# EAGLE design SSTC (EAGLE 9.2.0)
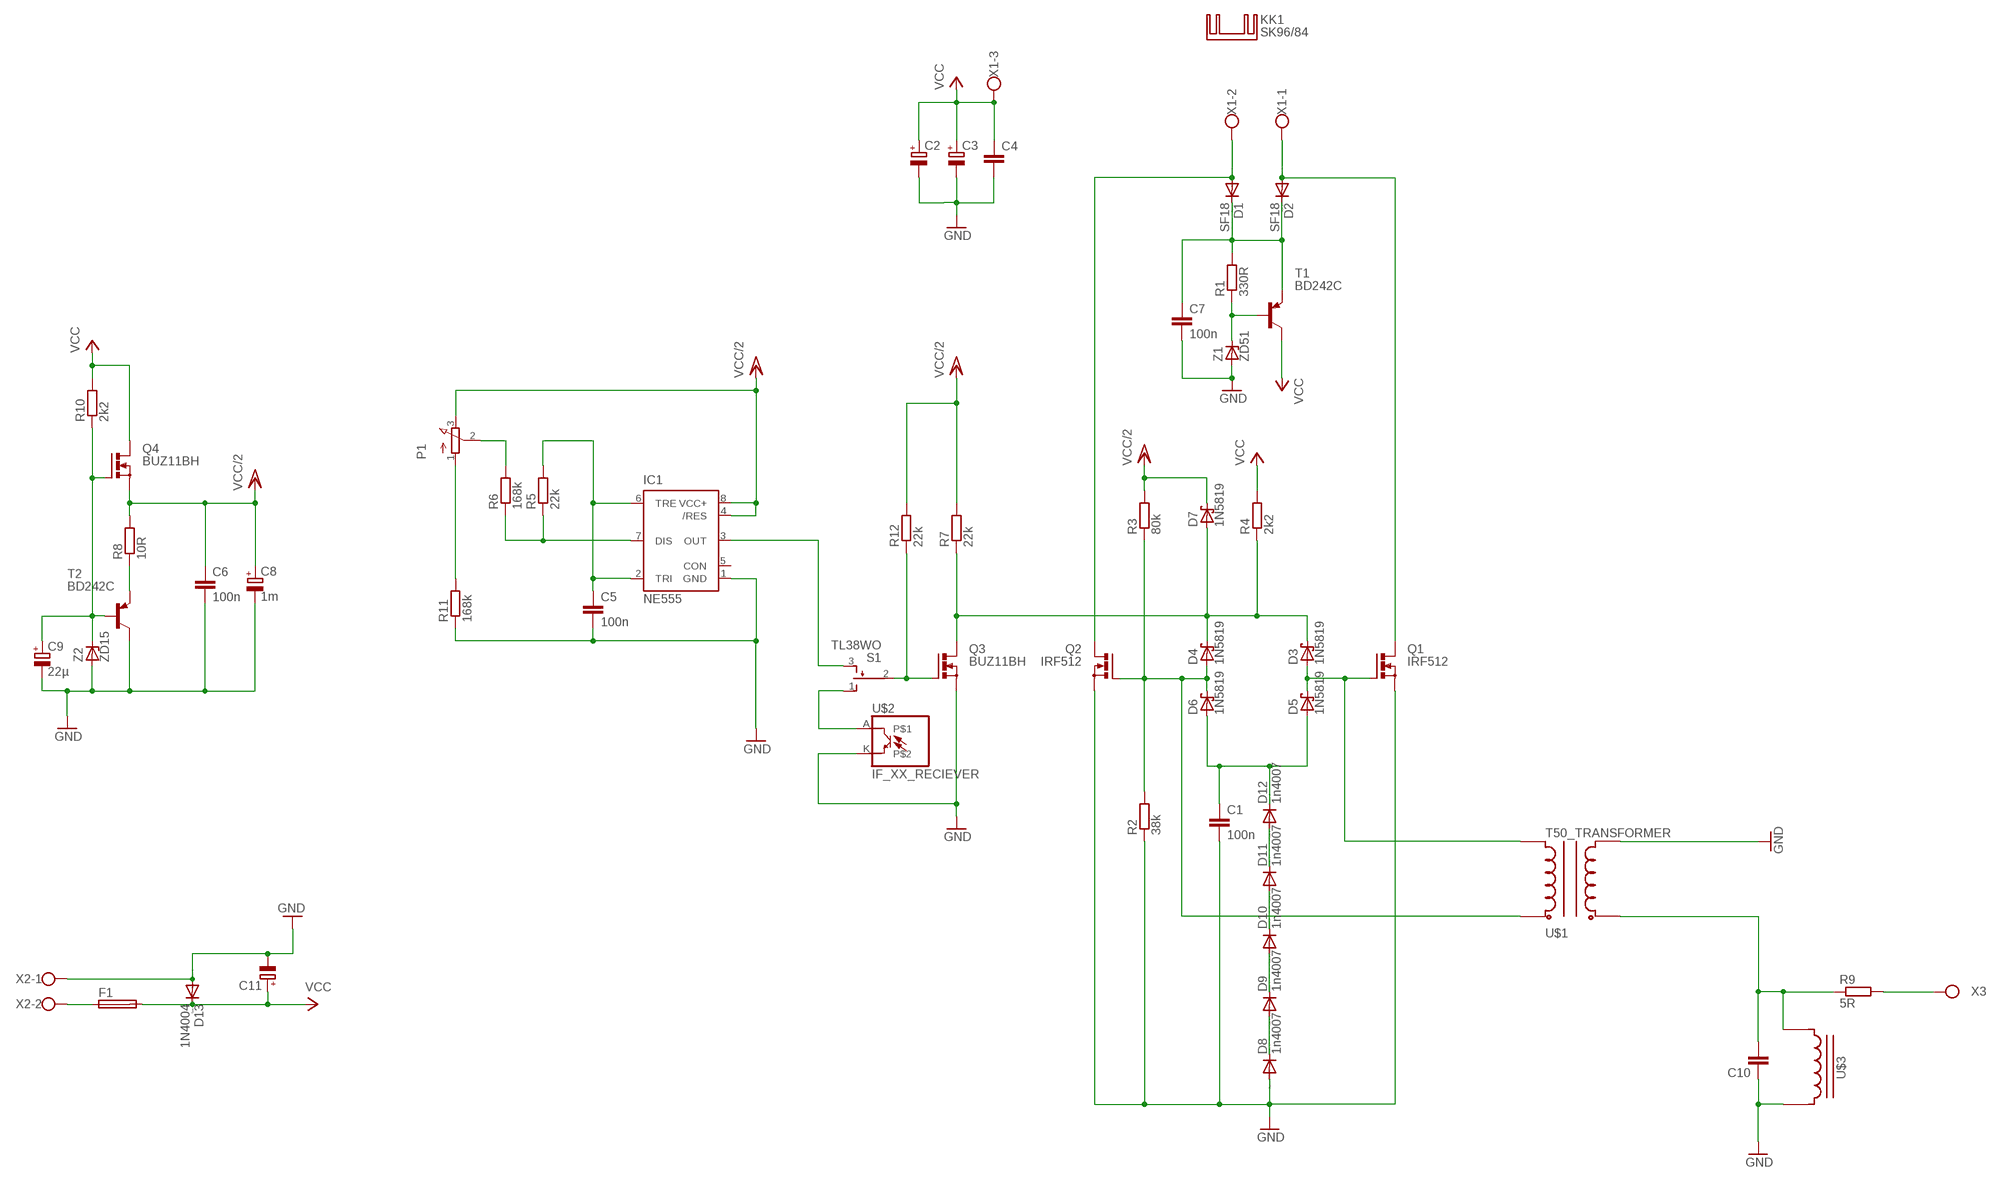
[diagram p0: schematic, sheet 1]

## Parts
C1  100n  C-EU075-032X103  [C075-032X103]
C2  CPOL-EUE7.5-18  [E7,5-18]
C3  CPOL-EUE7.5-18  [E7,5-18]
C4  C-EU150-072X183  [C150-072X183]
C5  100n  C-EU075-032X103  [C075-032X103]
C6  100n  C-EU075-032X103  [C075-032X103]
C7  100n  C-EU075-032X103  [C075-032X103]
C8  1m  CPOL-EUE5-10.5  [E5-10,5]
C9  22µ  CPOL-EUE5-8.5  [E5-8,5]
C10  C-EU102_152-062X184  [C102_152-062X184]
C11  CPOL-EUE7.5-18  [E7,5-18]
D1  SF18  DIODE-DO35-10  [DO35-10]
D2  SF18  DIODE-DO35-10  [DO35-10]
D3  1N5819  SCHOTTKY-DIODEF126Z12  [F126Z12]
D4  1N5819  SCHOTTKY-DIODEF126Z12  [F126Z12]
D5  1N5819  SCHOTTKY-DIODEF126Z12  [F126Z12]
D6  1N5819  SCHOTTKY-DIODEF126Z12  [F126Z12]
D7  1N5819  SCHOTTKY-DIODEF126Z12  [F126Z12]
D8  1n4007  DIODE-D-10  [D-10]
D9  1n4007  DIODE-D-10  [D-10]
D10  1n4007  DIODE-D-10  [D-10]
D11  1n4007  DIODE-D-10  [D-10]
D12  1n4007  DIODE-D-10  [D-10]
D13  1N4004  [DO41-10]
F1  SH22,5A  [SH22,5A]
IC1  NE555  [DIL-08]
KK1  SK96/84  [SK96/84]
P1  3RP/1610N  [3RP/1610N]
Q1  IRF512  [TO220BV]
Q2  IRF512  [TO220BV]
Q3  BUZ11BH  [TO220BH]
Q4  BUZ11BH  [TO220BH]
R1  330R  R-EU_0207/10  [0207/10]
R2  38k  R-EU_0207/10  [0207/10]
R3  80k  R-EU_0207/10  [0207/10]
R4  2k2  R-EU_0207/10  [0207/10]
R5  22k  R-EU_0207/10  [0207/10]
R6  168k  R-EU_0207/10  [0207/10]
R7  22k  R-EU_0207/10  [0207/10]
R8  10R  R-EU_0309/12  [0309/12]
R9  5R  R-EU_0613/5V  [P0613V]
R10  2k2  R-EU_0207/10  [0207/10]
R11  168k  R-EU_0309/12  [0309/12]
R12  22k  R-EU_0309/12  [0309/12]
S1  TL38WO  [TL3XWO]
T1  BD242C  -PNP-TO220V  [TO220V]
T2  BD242C  -PNP-TO220V  [TO220V]
U$1  T50_TRANSFORMER  [T50_TRANSFORMER]
U$2  IF_XX_RECIEVER  [IF_XX]
U$3  T50_INDUCTOR  [T50_INDUCTOR]
X1  W237-103  [W237-103]
X2  W237-102  [W237-102]
X3  W237-112  [W237-112]
Z1  ZD51  ZENER-DIODEDO35Z10  [DO35Z10]
Z2  ZD15  ZENER-DIODEDO35Z10  [DO35Z10]

## Nets
GND: C1.2 C2.- C3.- C4.2 C5.2 C6.2 C7.2 C8.- C9.- C10.1 C11.- D8.A D13.A IC1.1(GND) Q1.S Q2.S Q3.S R2.1 R11.1 T2.2(C) U$1.C2A U$2.K U$3.CA X2.1 Z1.A Z2.A
N$1: D8.C D9.A
N$2: D9.C D10.A
N$3: D10.C D11.A
N$4: D11.C D12.A
N$5: C1.1 D5.A D6.A D12.C
N$6: D4.A D6.C Q2.G R2.2 R3.1 U$1.C1B
N$7: D3.A D5.C Q1.G U$1.C1A
N$8: D1.A Q2.D X1.2
N$9: D2.A Q1.D X1.1
N$10: D3.C D4.C D7.A Q3.D R4.1 R7.1
N$11: C7.1 D1.C D2.C R1.2 T1.3(E)
N$12: R1.1 T1.1(B) Z1.C
N$13: C10.2 R9.1 U$1.C2B U$3.CB
N$14: R9.2 X3.1(KL)
N$15: F1.1 X2.2
N$16: C9.+ Q4.G R10.1 T2.1(B) Z2.C
N$17: R8.1 T2.3(E)
N$18: IC1.7(DIS) R5.1 R6.1
N$19: C5.1 IC1.2(TRI) IC1.6(TRE) R5.2
N$20: P1.2(S) R6.2
N$21: P1.1(A) R11.2
N$22: Q3.G R12.1 S1.2(P)
N$23: IC1.3(OUT) S1.3(S)
N$24: S1.1(O) U$2.A
VCC: C2.+ C3.+ C4.1 C11.+ D13.C F1.2 Q4.D R4.2 R10.2 T1.2(C) X1.3
VCC/2: C6.1 C8.+ D7.C IC1.4(/RES) IC1.8(VCC+) P1.3(E) Q4.S R3.2 R7.2 R8.2 R12.2
Unconnected: IC1.5(CON)

## Library data of the parts
C1 C4-C7 C10 = rcl:C-EU: CAPACITOR, European symbol; SPICEPREFIX: C
C2 C3 C8 C9 C11 = rcl:CPOL-EU: POLARIZED CAPACITOR, European symbol; SPICEPREFIX: C
D1 D2 D8-D12 = diode:DIODE-: DIODE
D3-D7 = diode:SCHOTTKY-DIODE: Schottky Diode
D13 = diode:1N4004: DIODE general purpose rectifier, 1 A
F1 = fuse:SH22,5A: FUSE HOLDER grid 22,5mm, isolated cap OGN0031 8201, Schurter (Buerklin); MPN: 0031.7701.11; OC_FARNELL: unknown; OC_NEWARK: 04F1224
IC1 = st-microelectronics:NE555: General purpose bipolar Timer; MF: Arrow Electronics; MPN: NE555N; OC_FARNELL: 1467742; OC_NEWARK: 89K1486
KK1 = heatsink:SK96/84: HEATSINK manufacturer Fischer/distributor Buerklin
P1 = pot:3RP/1610N: 16mm Potentiometer one level Source: http://www.alphapotentiometers.net/html/16mm_pot_2.html
Q1 Q2 = transistor-power:IRF512: N-CHANNEL MOS FET
Q3 Q4 = transistor-power:BUZ11: N-CHANNEL MOS FET
R1-R12 = rcl:R-EU_: RESISTOR, European symbol; SPICEPREFIX: R
S1 = switch:TL38WO: TINY SWITCH ON OFF MOM Source: http://www2.produktinfo.conrad.com/datenblaetter/700000-724999/705152-da-01-de-Subminiaturschalter_TL_36WO.pdf
T1 T2 = transistor:*-PNP-: PNP Transistror
U$1 = toroid:T50_TRANSFORMER: Transformer on a T50 Toroid
U$2 = Industrial_Fiberoptics:IF_XX_RECIEVER
U$3 = toroid:T50_INDUCTOR: Inductor wound on a T50 Core
X1 = con-wago-500:W237-103: WAGO SCREW CLAMP; MPN: 237-103; OC_FARNELL: unknown; OC_NEWARK: 18M7116
X2 = con-wago-500:W237-102: WAGO SCREW CLAMP; MPN: 237-102; OC_FARNELL: unknown; OC_NEWARK: 70K9898
X3 = con-wago-500:W237-112: WAGO SCREW CLAMP; MPN: 237-112; OC_FARNELL: unknown; OC_NEWARK: 76R2974
Z1 Z2 = diode:ZENER-DIODE: Z-Diode

## Board
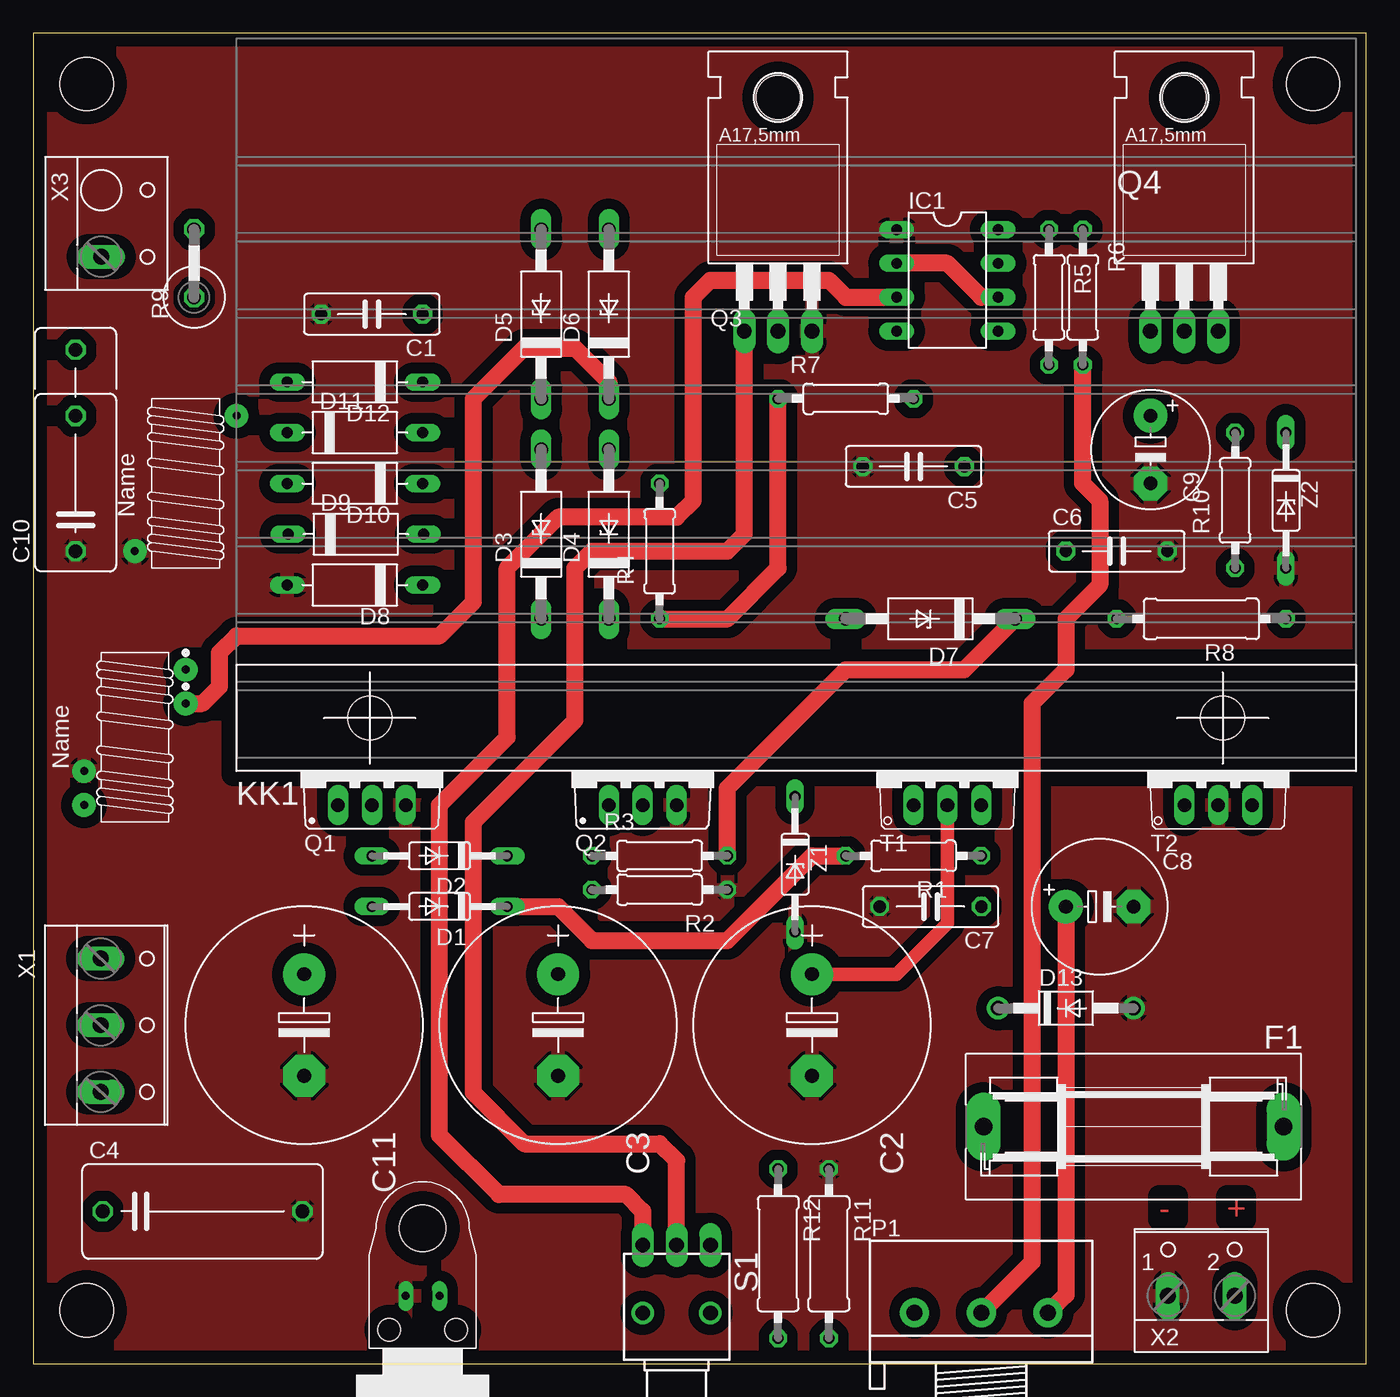
[diagram p1: board, top side]
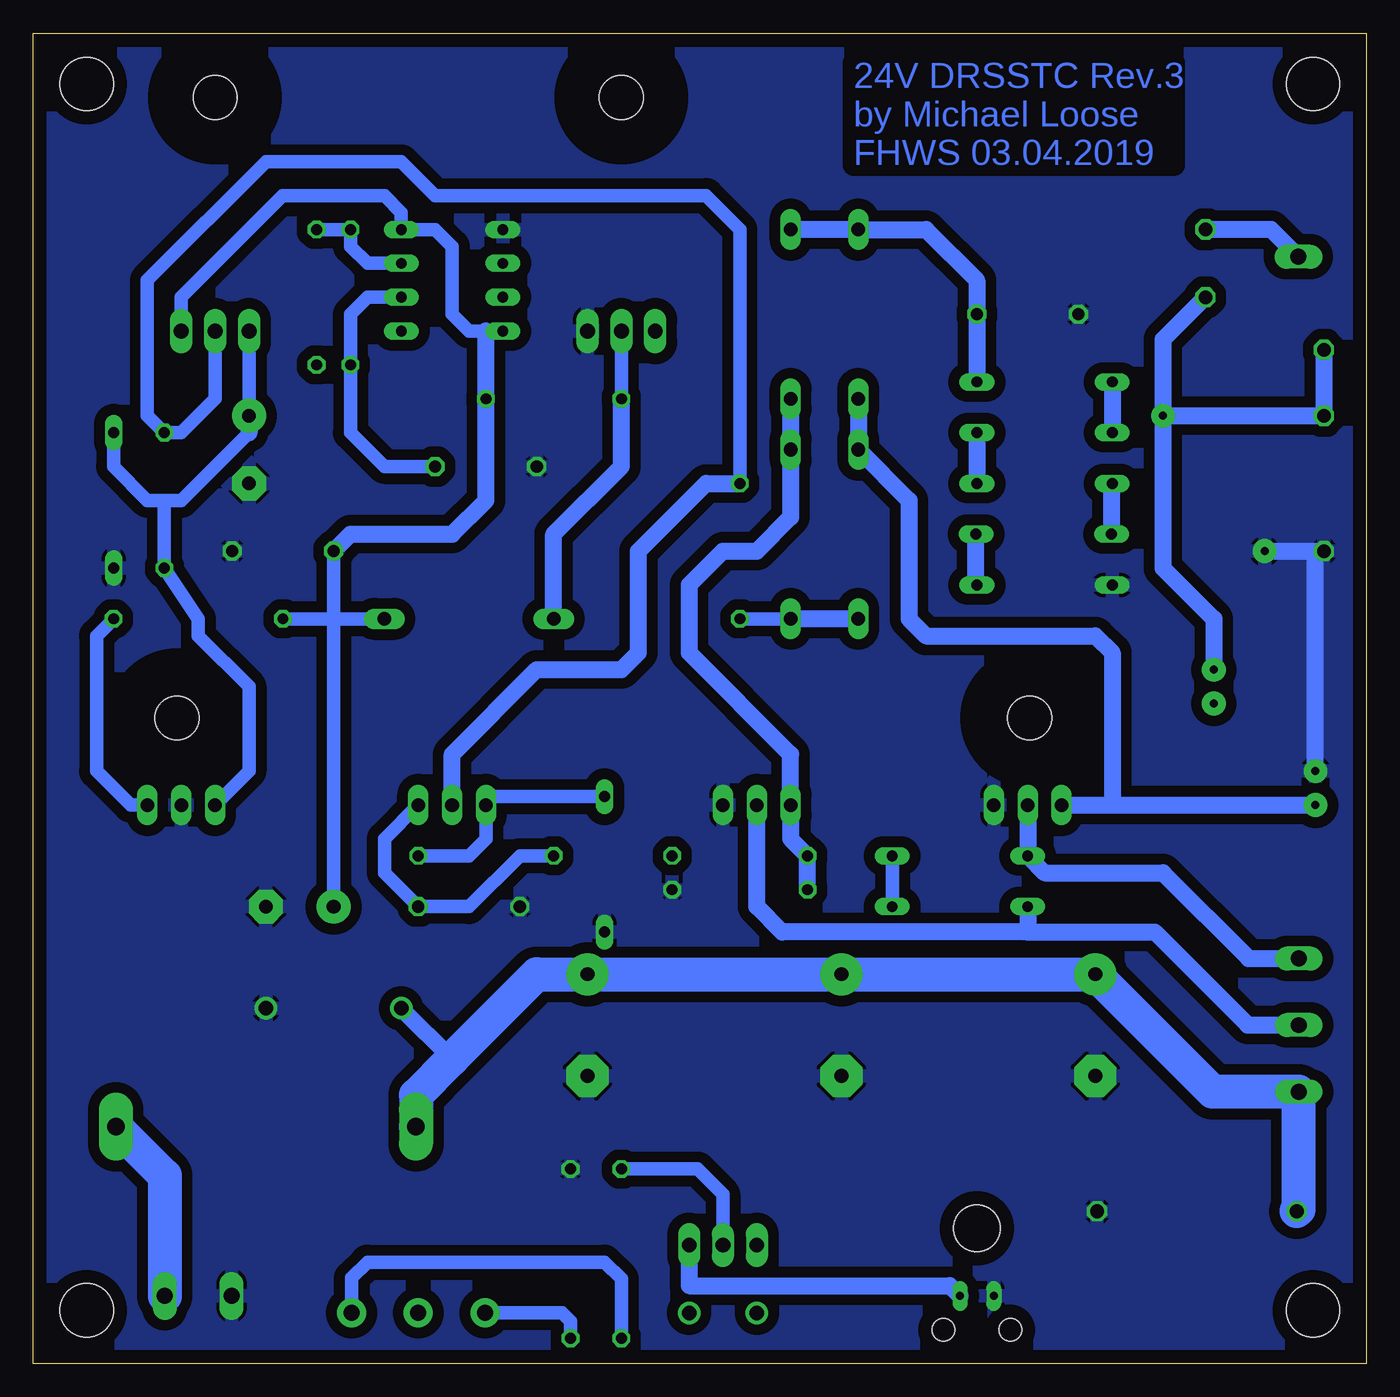
[diagram p2: board, bottom side, seen from below]

Size 100 x 99.81 mm. Coordinates in mm from the lower left corner, seen from the top.
Outline: 0,0 100,0 100,99.81 0,99.81 0,0
Copper layers (1*16): Top 0.035mm / dielectric 1.5mm / Bottom 0.035mm
Design rules "default": minimum track width 6mil, minimum drill 0.35mm, track to track 6mil, track to pad 6mil, pad to pad 6mil, via to via 6mil, smd to smd 6mil, copper to edge 40mil, drill to drill 6mil, minimum pad ring 10mil, minimum via ring 8mil, stop-mask expansion 4mil, vias tented up to drill 0mil, thermal gap 10mil
Holes 4 mm at 4,4 4,96 96,96 96,4

### Footprints (pad centres in the part's own frame; a part is rotated, then mirrored left to right if it is on the bottom)
C075-032X103 = drill 0.914 octagon: 1 -3.81,0; 2 3.81,0
E7,5-18 = drill 1.016 pad 3.15: + -3.81,0 | drill 1.016 pad 3.15 octagon: - 3.81,0
C150-072X183 = drill 1.016 octagon: 1 -7.493,0; 2 7.493,0
E5-10,5 = drill 1.016 pad 2.54: + -2.54,0 | drill 1.016 pad 2.54 octagon: - 2.54,0
E5-8,5 = drill 1.016 pad 2.54: + -2.54,0 | drill 1.016 pad 2.54 octagon: - 2.54,0
C102_152-062X184 = drill 1.016 octagon: 1 -5.08,0; 2 5.08,0; 3 10.033,0
DO35-10 = drill 0.813 long: A 5.08,0; C -5.08,0
F126Z12 = drill 1.016 long: A 6.35,0; C -6.35,0
D-10 = drill 0.813 long: A 5.08,0; C -5.08,0
DO41-10 = drill 1.118: A 5.08,0; C -5.08,0
SH22,5A = drill 1.321 pad 2.54 long: 1 -11.252,0; 2 11.252,0
DIL-08 = drill 0.813 long: 1 -3.81,-3.81; 2 -1.27,-3.81; 3 1.27,-3.81; 4 3.81,-3.81; 5 3.81,3.81; 6 1.27,3.81; 7 -1.27,3.81; 8 -3.81,3.81
SK96/84 = hole 3.302: -31.902,3.988; 32.08,3.988
3RP/1610N = drill 1.2 pad 2.184: 1 -5,0; 2 0,0; 3 5,0
TO220BV = drill 1.016 long: D 0,-2.54; G -2.54,-2.54; S 2.54,-2.54
TO220BH = drill 1.118 long: D 0,-6.35; G -2.54,-6.35; S 2.54,-6.35 | hole 3.302: 0,11.176
0207/10 = drill 0.813 octagon: 1 -5.08,0; 2 5.08,0
0309/12 = drill 0.813 octagon: 1 -6.35,0; 2 6.35,0
P0613V = drill 1.016 octagon: 1 -2.54,0; 2 2.54,0
TL3XWO = drill 1.1 pad 1.422 long: 1 -2.54,-5.08; 2 0,-5.08; 3 2.54,-5.08 | drill 1.1 pad 1.676: M1 -2.54,0; M2 2.54,0
TO220V = drill 1.016 long: 1 -2.54,-2.54; 2 0,-2.54; 3 2.54,-2.54
T50_TRANSFORMER = drill 0.6 pad 1.778: C1A -3.81,-5.08; C1B 3.81,2.54; C2A -3.81,-2.54; C2B 3.81,5.08
IF_XX = drill 0.6 long: A -1.27,5.08; K 1.27,5.08 | hole 3.5: 0,0 | hole 1.7: -2.504,7.62; 2.504,7.62
T50_INDUCTOR = drill 0.6 pad 1.778: CA -3.81,-5.08; CB 3.81,5.08
W237-103 = drill 1.194 long: 1 -5,-1.29; 2 0,-1.29; 3 5,-1.29
W237-102 = drill 1.194 long: 1 -2.5,-1.27; 2 2.5,-1.27
W237-112 = drill 1.194 long: 1 2.5,-1.27
DO35Z10 = drill 0.813 long: A 5.08,0; C -5.08,0

### Placement (x,y rotation side)
C1  25.4,78.74 180 top
C2  58.42,25.4 270 top
C3  39.37,25.4 270 top
C4  12.7,11.43 0 top
C5  66.04,67.31 180 top
C6  81.28,60.96 0 top
C7  67.31,34.29 180 top
C8  80.01,34.29 0 top
C9  83.82,68.58 270 top
C10  3.17,66.04 90 top
C11  20.32,25.4 270 top
D1  30.48,34.29 180 top
D2  30.48,38.1 180 top
D3  38.1,62.23 90 top
D4  43.18,62.23 90 top
D5  38.1,78.74 90 top
D6  43.18,78.74 90 top
D7  67.31,55.88 180 top
D8  24.13,58.42 180 top
D9  24.19,62.23 0 top
D10  24.13,66.04 180 top
D11  24.13,69.85 0 top
D12  24.13,73.66 180 top
D13  77.47,26.67 0 top
F1  82.55,17.78 180 top
IC1  68.58,81.28 270 top
KK1  57.15,44.45 0 top
P1  71.12,3.81 0 top
Q1  25.4,44.45 0 top
Q2  45.72,44.45 0 top
Q3  55.88,83.82 0 top
Q4  86.36,83.82 0 top
R1  66.04,38.1 180 top
R2  46.99,35.56 180 top
R3  46.99,38.1 0 top
R4  46.99,60.96 90 top
R5  76.2,80.01 270 top
R6  78.74,80.01 270 top
R7  60.96,72.39 0 top
R8  87.63,55.88 180 top
R9  12.06,82.55 90 top
R10  90.17,64.77 90 top
R11  59.69,8.26 270 top
R12  55.88,8.26 270 top
S1  48.26,3.81 180 top
T1  68.58,44.45 0 top
T2  88.9,44.45 0 top
U$1  7.62,46.99 0 top
U$2  29.21,10.16 180 top
U$3  11.43,66.04 0 top
X1  6.35,25.4 270 top
X2  87.63,6.35 0 top
X3  6.35,85.55 270 top
Z1  57.15,37.47 270 top
Z2  93.98,64.77 270 top

### Tracks (layer width: path | path; a pad name or v marks a point on that pad's centre or on a via)
GND
  Bottom 1.27: U$3.CA 3.81,60.96 | 3.81,60.96 C10.1 | U$1.C2A 3.81,60.96
  pour Top (isolate 0.813): 0,100 0,0 100.33,0 100,100
  pour Bottom (isolate 0.813): 0,100 100,100 100.33,0 0,0
N$1
  Bottom 1.27: 29.21,62.17 D9.A 29.27,58.48 D8.C
N$2
  Bottom 1.27: D10.A 19.11,65.98 D9.C
N$3
  Bottom 1.27: D11.A D10.C
N$4
  Bottom 1.27: D12.A D11.C
N$5
  Bottom 1.27: D6.A D5.A 33.02,85.09 29.21,81.28 C1.1 D12.C
N$6
  Top 1.27: U$1.C1B 12.7,49.53 13.97,50.8 13.97,53.34 15.24,54.61 30.48,54.61 33.02,57.15 33.02,72.39 36.83,76.2 40.64,76.2 43.18,73.66 D6.C
  Bottom 1.27: R2.2 R3.1 43.18,39.37 Q2.G 43.18,45.72 50.8,53.34 50.8,58.42 48.26,60.96 45.72,60.96 43.18,63.5 D4.A D6.C
N$7
  Bottom 1.27: D5.C D3.A 34.29,64.77 34.29,55.88 33.02,54.61 20.32,54.61 19.05,53.34 19.05,41.91 | Q1.G 19.05,41.91 | 19.05,41.91 U$1.C1A
N$8
  Bottom 1.27: X1.2 8.89,25.4 15.88,32.38 25.4,32.38 | D1.A 25.4,32.38 | 25.4,32.38 43.81,32.38 45.72,34.29 Q2.D
N$9
  Bottom 1.27: Q1.D D2.A 24.13,36.83 15.24,36.83 8.81,30.4 X1.1
N$10
  Top 1.27: R4.1 52.07,55.88 55.88,59.69 R7.1
  Bottom 1.016: R7.1 Q3.D | D4.C R4.1
  Bottom 1.27: D3.C D4.C | D7.A 60.96,62.23 55.88,67.31 R7.1
N$11
  Top 1.27: D1.C 39.37,34.29 41.91,31.75 52.07,31.75 58.42,38.1 R1.2
  Bottom 1.016: T1.3 73.66,39.37 73.66,36.83 C7.1 67.31,34.29 63.5,38.1 R1.2 | D2.C D1.C
N$12
  Bottom 1.016: Z1.C 65.41,42.55 T1.1 66.04,39.37 67.31,38.1 R1.1
N$13
  Bottom 1.27: U$3.CB C10.2 3.17,76.2 | U$3.CB 15.24,59.69 11.43,55.88 U$1.C2B | R9.1 15.24,76.83 U$3.CB
N$14
  Bottom 1.27: X3.1 7.12,85.09 R9.2
N$15
  Bottom 2.54: F1.1 90.13,14.11 X2.2
N$16
  Bottom 1.016: Q4.G 83.82,69.85 88.9,64.77 90.17,64.77 | T2.1 83.82,44.45 83.82,50.8 87.63,54.61 87.63,55.88 R10.1 90.17,64.77 | Z2.C 93.98,67.31 91.44,64.77 90.17,64.77
  Bottom 1.27: C9.+ 83.82,69.85
N$17
  Bottom 1.016: R8.1 95.25,54.61 95.25,44.45 92.71,41.91 T2.3
N$18
  Bottom 1.016: IC1.7 74.93,82.55 76.2,83.82 R5.1 R6.1
N$19
  Top 1.27: IC1.6 71.12,80.01 68.58,82.55 IC1.2
  Bottom 1.016: C5.1 73.66,67.31 76.2,69.85 R5.2 76.2,78.74 74.93,80.01 IC1.6
N$20
  Top 1.27: P1.2 74.93,7.62 74.93,49.53 77.47,52.07 77.47,55.88 80.01,58.42 80.01,64.77 78.74,66.04 R6.2
N$21
  Bottom 1.016: R11.2 59.69,3.17 60.33,3.81 P1.1
N$22
  Top 1.27: S1.2 48.26,15.24 46.99,16.51 36.83,16.51 33.02,20.32 33.02,40.64 40.64,48.26 40.64,59.69 41.91,60.96 52.07,60.96 53.34,62.23 Q3.G
  Bottom 1.016: R12.1 50.16,14.61 48.26,12.7 S1.2
N$23
  Top 1.27: S1.3 45.72,11.43 44.45,12.7 34.92,12.7 30.48,17.14 30.48,38.1 30.48,41.91 35.56,46.99 35.56,59.69 39.37,63.5 48.26,63.5 49.53,64.77 49.53,80.01 50.8,81.28 59.69,81.28 60.96,80.01 IC1.3
N$24
  Bottom 1.27: U$2.A 31.24,5.84 50.8,5.84 S1.1
VCC
  Top 1.016: T1.2 68.58,33.02 64.77,29.21 C2.+
  Bottom 1.016: Q4.D 86.36,72.39 88.9,69.85 R10.2 91.44,71.12 91.44,81.28 82.55,90.17 72.39,90.17 69.85,87.63 49.53,87.63 46.99,85.09 R4.2
  Bottom 1.27: D13.C 68.58,22.86 | T1.2 68.58,45.72 62.23,52.07 55.88,52.07 54.61,53.34 54.61,60.96 49.53,66.04 R4.2
  Bottom 2.54: F1.2 71.3,20.14 68.58,22.86 62.23,29.21 C2.+ C3.+ C11.+ 11.51,20.4 X1.3 5.06,11.58 C4.1
VCC/2
  Top 1.27: C8.+ 77.47,5.16 P1.3 | R3.2 52.07,43.18 60.96,52.07 69.85,52.07 D7.C
  Bottom 1.016: C6.1 77.47,55.88 | 77.47,55.88 C8.+ | 77.47,55.88 R8.2 D7.C | IC1.4 66.04,77.47 67.31,77.47 68.58,78.74 68.58,83.82 69.85,85.09 IC1.8 72.39,86.36 73.66,87.63 81.28,87.63 88.9,80.01 Q4.S | P1.3 76.12,6.43 74.93,7.62 57.15,7.62 55.88,6.35 R12.2
  Bottom 1.27: C6.1 76.2,62.23 68.58,62.23 66.04,64.77 R7.2 66.04,77.47

### Text on the board
Top: - | +
Bottom: 24V DRSSTC Rev.3 / by Michael Loose / FHWS 03.04.2019